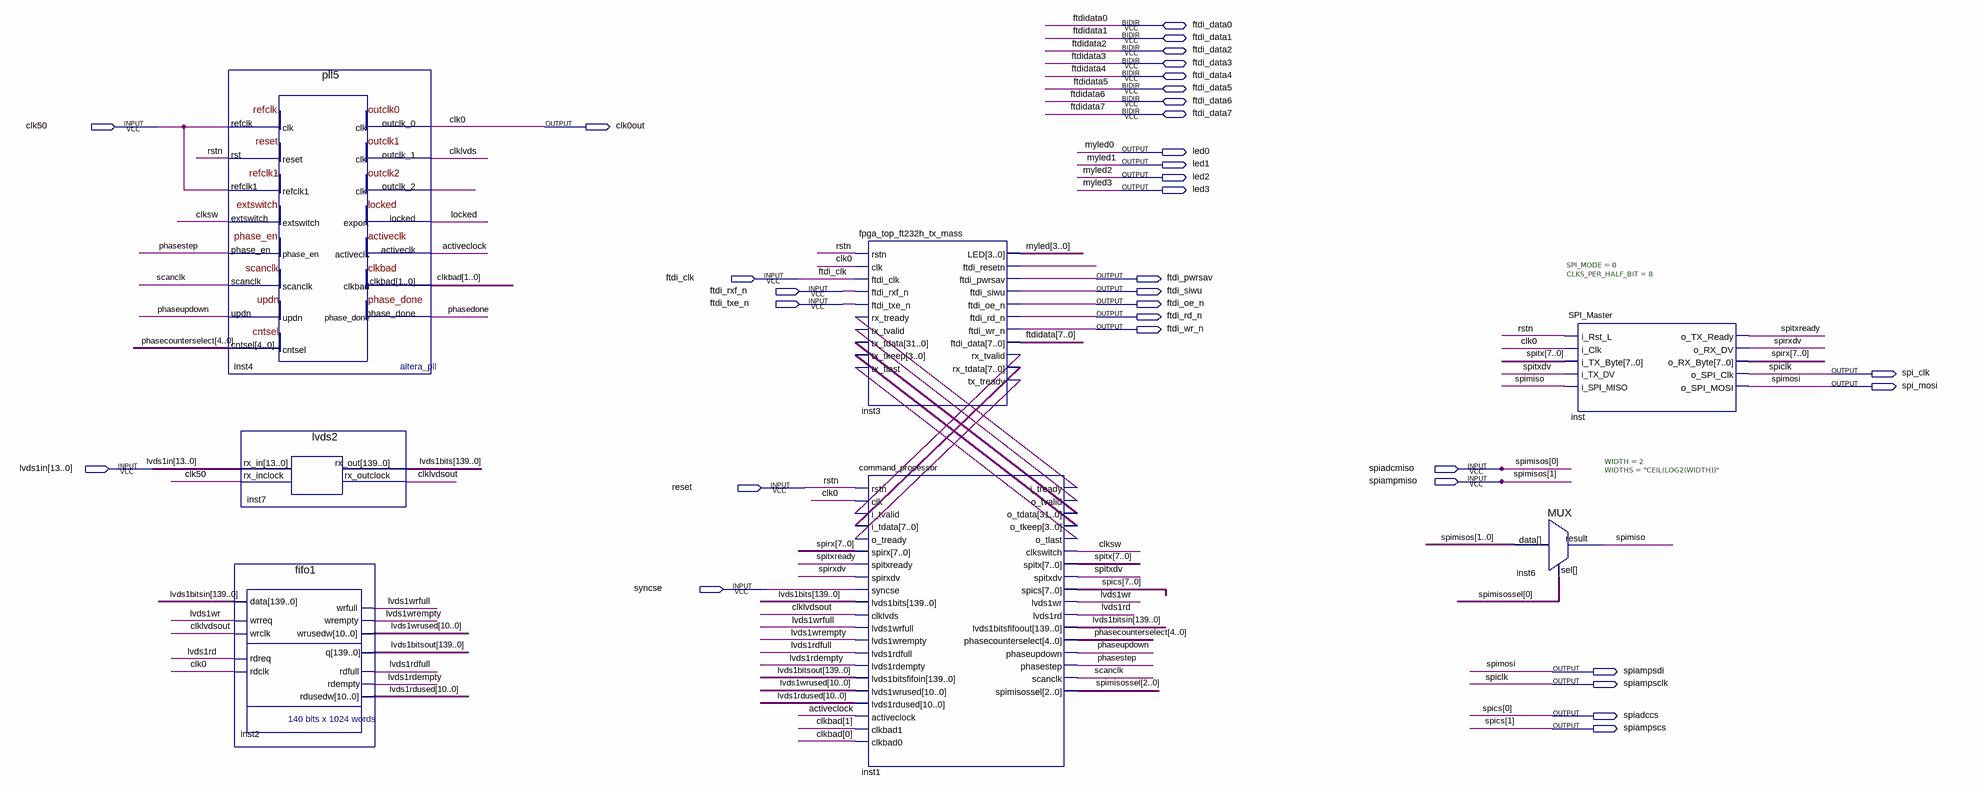
[diagram p0: schematic sheet]
// Quartus schematic coincidence.bdf as structural Verilog: 7 symbols, 33 pins
module coincidence (
  input  clk50,
  input  ftdi_clk,
  input  ftdi_rxf_n,
  input  ftdi_txe_n,
  input  [13:0] lvds1in,
  input  spiadcmiso,
  input  spiampmiso,
  input  reset,
  input  syncse,
  inout  ftdi_data0,
  inout  ftdi_data1,
  inout  ftdi_data2,
  inout  ftdi_data3,
  inout  ftdi_data4,
  inout  ftdi_data5,
  inout  ftdi_data6,
  inout  ftdi_data7,
  output clk0out,
  output led0,
  output led1,
  output led2,
  output led3,
  output ftdi_pwrsav,
  output ftdi_siwu,
  output ftdi_oe_n,
  output ftdi_rd_n,
  output ftdi_wr_n,
  output spi_clk,
  output spi_mosi,
  output spiampsdi,
  output spiampsclk,
  output spiadccs,
  output spiampscs
);

  wire activeclock, clklvds, clklvdsout, clksw, inst1_i_tready, inst1_o_tlast, inst1_o_tvalid,
       inst3_ftdi_resetn, inst3_rx_tvalid, inst3_tx_tready, inst4_outclk_2, locked, lvds1rd, lvds1rdempty,
       lvds1rdfull, lvds1wr, lvds1wrempty, lvds1wrfull, phasedone, phasestep, phaseupdown, scanclk, spimiso,
       spirxdv, spitxdv, spitxready;
  wire [1:0] clkbad;
  wire [2:0] spimisossel;
  wire [3:0] inst1_o_tkeep;
  wire [4:0] phasecounterselect;
  wire [7:0] inst3_rx_tdata, spirx, spitx;
  wire [7:2] spics;
  wire [10:0] lvds1rdused, lvds1wrused;
  wire [31:0] inst1_o_tdata;
  wire [139:0] lvds1bits, lvds1bitsin, lvds1bitsout;

  pll5 inst4 (
    .refclk(clk50), .rst(reset), .refclk1(clk50), .extswitch(clksw), .phase_en(phasestep), .scanclk(scanclk),
    .updn(phaseupdown), .cntsel(phasecounterselect), .outclk_0(clk0out), .outclk_1(clklvds),
    .outclk_2(inst4_outclk_2), .locked(locked), .activeclk(activeclock), .clkbad(clkbad),
    .phase_done(phasedone));
  fifo1 inst2 (
    .data(lvds1bitsin), .wrreq(lvds1wr), .wrclk(clklvdsout), .rdreq(lvds1rd), .rdclk(clk0out),
    .wrfull(lvds1wrfull), .wrempty(lvds1wrempty), .wrusedw(lvds1wrused), .q(lvds1bitsout),
    .rdfull(lvds1rdfull), .rdempty(lvds1rdempty), .rdusedw(lvds1rdused));
  lvds2 inst7 (.rx_in(lvds1in), .rx_inclock(clk50), .rx_out(lvds1bits), .rx_outclock(clklvdsout));
  fpga_top_ft232h_tx_mass inst3 (
    .rstn(reset), .clk(clk0out), .ftdi_clk(ftdi_clk), .ftdi_rxf_n(ftdi_rxf_n), .ftdi_txe_n(ftdi_txe_n),
    .rx_tready(inst1_i_tready), .tx_tvalid(inst1_o_tvalid), .tx_tdata(inst1_o_tdata),
    .tx_tkeep(inst1_o_tkeep), .tx_tlast(inst1_o_tlast), .LED({led3, led2, led1, led0}),
    .ftdi_resetn(inst3_ftdi_resetn), .ftdi_pwrsav(ftdi_pwrsav), .ftdi_siwu(ftdi_siwu), .ftdi_oe_n(ftdi_oe_n),
    .ftdi_rd_n(ftdi_rd_n), .ftdi_wr_n(ftdi_wr_n), .rx_tvalid(inst3_rx_tvalid), .rx_tdata(inst3_rx_tdata),
    .tx_tready(inst3_tx_tready),
    .ftdi_data({ftdi_data7, ftdi_data6, ftdi_data5, ftdi_data4, ftdi_data3, ftdi_data2, ftdi_data1, ftdi_data0}));
  command_processor inst1 (
    .rstn(reset), .clk(clk0out), .i_tvalid(inst3_rx_tvalid), .i_tdata(inst3_rx_tdata),
    .o_tready(inst3_tx_tready), .spirx(spirx), .spitxready(spitxready), .spirxdv(spirxdv), .syncse(syncse),
    .lvds1bits(lvds1bits), .clklvds(clklvdsout), .lvds1wrfull(lvds1wrfull), .lvds1wrempty(lvds1wrempty),
    .lvds1rdfull(lvds1rdfull), .lvds1rdempty(lvds1rdempty), .lvds1bitsfifoin(lvds1bitsout),
    .lvds1wrused(lvds1wrused), .lvds1rdused(lvds1rdused), .activeclock(activeclock), .clkbad1(clkbad[1]),
    .clkbad0(clkbad[0]), .i_tready(inst1_i_tready), .o_tvalid(inst1_o_tvalid), .o_tdata(inst1_o_tdata),
    .o_tkeep(inst1_o_tkeep), .o_tlast(inst1_o_tlast), .clkswitch(clksw), .spitx(spitx), .spitxdv(spitxdv),
    .spics({spics, spiampscs, spiadccs}), .lvds1wr(lvds1wr), .lvds1rd(lvds1rd),
    .lvds1bitsfifoout(lvds1bitsin), .phasecounterselect(phasecounterselect), .phaseupdown(phaseupdown),
    .phasestep(phasestep), .scanclk(scanclk), .spimisossel(spimisossel));
  MUX #(.WIDTH(2), .WIDTHS("CEIL(LOG2(WIDTH))")) inst6 (
    .data({spiampmiso, spiadcmiso}), .sel(spimisossel[0]), .result(spimiso));
  SPI_Master #(.SPI_MODE(0), .CLKS_PER_HALF_BIT(8)) inst (
    .i_Rst_L(reset), .i_Clk(clk0out), .i_TX_Byte(spitx), .i_TX_DV(spitxdv), .i_SPI_MISO(spimiso),
    .o_TX_Ready(spitxready), .o_RX_DV(spirxdv), .o_RX_Byte(spirx), .o_SPI_Clk(spi_clk), .o_SPI_MOSI(spi_mosi));

  assign spiampsclk = spi_clk;
  assign spiampsdi = spi_mosi;

  // Other names for the same wires on the sheet: clk0 = clk0out;
  //   ftdidata[7:0] = {ftdi_data7, ftdi_data6, ftdi_data5, ftdi_data4, ftdi_data3, ftdi_data2, ftdi_data1, ftdi_data0};
  //   ftdidata0 = ftdi_data0; ftdidata1 = ftdi_data1; ftdidata2 = ftdi_data2; ftdidata3 = ftdi_data3;
  //   ftdidata4 = ftdi_data4; ftdidata5 = ftdi_data5; ftdidata6 = ftdi_data6; ftdidata7 = ftdi_data7;
  //   myled[3:0] = {led3, led2, led1, led0}; myled0 = led0; myled1 = led1; myled2 = led2; myled3 = led3; rstn = reset;
  //   spimisos[1:0] = {spiampmiso, spiadcmiso}; spiclk = spi_clk; spics[1:0] = {spiampscs, spiadccs};
  //   spimosi = spi_mosi
endmodule
